# Altium project rx.PrjPcb
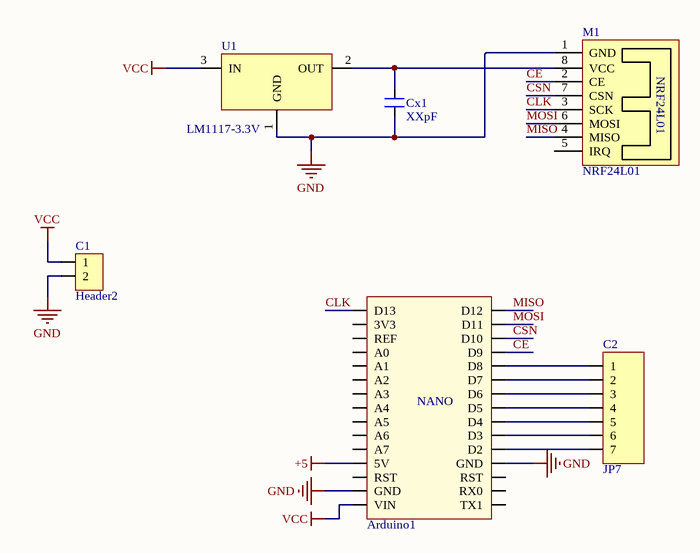
[diagram p0: rxv1.SchDoc]
1 sheet, 6 parts. Net scope: global (net labels, ports and power ports of the same name join across sheets).
Board file: PCB.PcbDoc

## Sheet rxv1.SchDoc
size A4

### Parts
Arduino1  Arduino Nano  [Arduino Nano]  (value not drawn)
C1  Header2  [Header2]
C2  JP7  [JP7-C1T]
Cx1  XXpF  [CN-SMD-1206]
M1  NRF24L01  [NRF24L01]
U1  LM1117-3.3V  [SOT223]

### Nets
+5: Arduino1.5V
GND: Arduino1.GND C1.2 Cx1.1 M1.1(GND) U1.1(GND)
VCC: Arduino1.VIN C1.1 U1.3(IN)
CE: Arduino1.D9 M1.2(CE)
CLK: Arduino1.D13 M1.3(SCK)
CSN: Arduino1.D10 M1.7(CSN)
MISO: Arduino1.D12 M1.4(MISO)
MOSI: Arduino1.D11 M1.6(MOSI)
NetArduino1_D2: Arduino1.D2 C2.7
NetArduino1_D3: Arduino1.D3 C2.6
NetArduino1_D4: Arduino1.D4 C2.5
NetArduino1_D5: Arduino1.D5 C2.4
NetArduino1_D6: Arduino1.D6 C2.3
NetArduino1_D7: Arduino1.D7 C2.2
NetArduino1_D8: Arduino1.D8 C2.1
NetCx1_2: Cx1.2 M1.8(VCC) U1.2(OUT)

Not connected (* = marked no-connect by the designer): Arduino1 3V3 A0 A1 A2 A3 A4 A5 A6 A7 REF RST RX0 TX1; M1 5(IRQ)

### Notes on the sheet
- (in symbol Arduino Nano) NANO

### Library data of the parts
Arduino1 = Arduino Nano: Value: Cau 1A
C1 = Header2: Header IDC, 2 x 1 Pin Vertical 2.54mm Pitch (Non-Boxed, Male); Manufacturer: W¨¹rth Elektronik eiSos GmbH; partNo: 613002143121; ComponentLink1 Description: Manufacturer; ComponentLink2 Description: Datasheet; NoPins: 02; Created Date: 29 March 2013; ComponentLink1URL: http://www.we-online.com; ComponentLink2URL: http://katalog.we-online.de/em/datasheet/6130xx143121.pdf; Created by: Karrer Zheng
C2 = JP7: WR-PHD 2.54 mm Angled Socket Header; Manufacturer: W¨¹rth Elektronik eiSos GmbH; partNo: 613007143121; ComponentLink1 Description: Manufacturer; ComponentLink2 Description: Datasheet; NoPins: 07; Created Date: 29 March 2013; ComponentLink1URL: http://www.we-online.com; ComponentLink2URL: http://katalog.we-online.de/em/datasheet/6130xx143121.pdf; Created by: Karrer Zheng
Cx1 = CN: Value: 33pF
U1 = LM1117: 800mA Low-Dropout Linear Regulator; Creator: Nguyen Ba Bien; Website: http://group3i.net